# EAGLE schematic switcher (EAGLE 7.4.0)
Line-Tracking Robot Project
DATE: 2015/09/23; DESIGNER: iPAS; PROJECT: Line-Tracking Robot
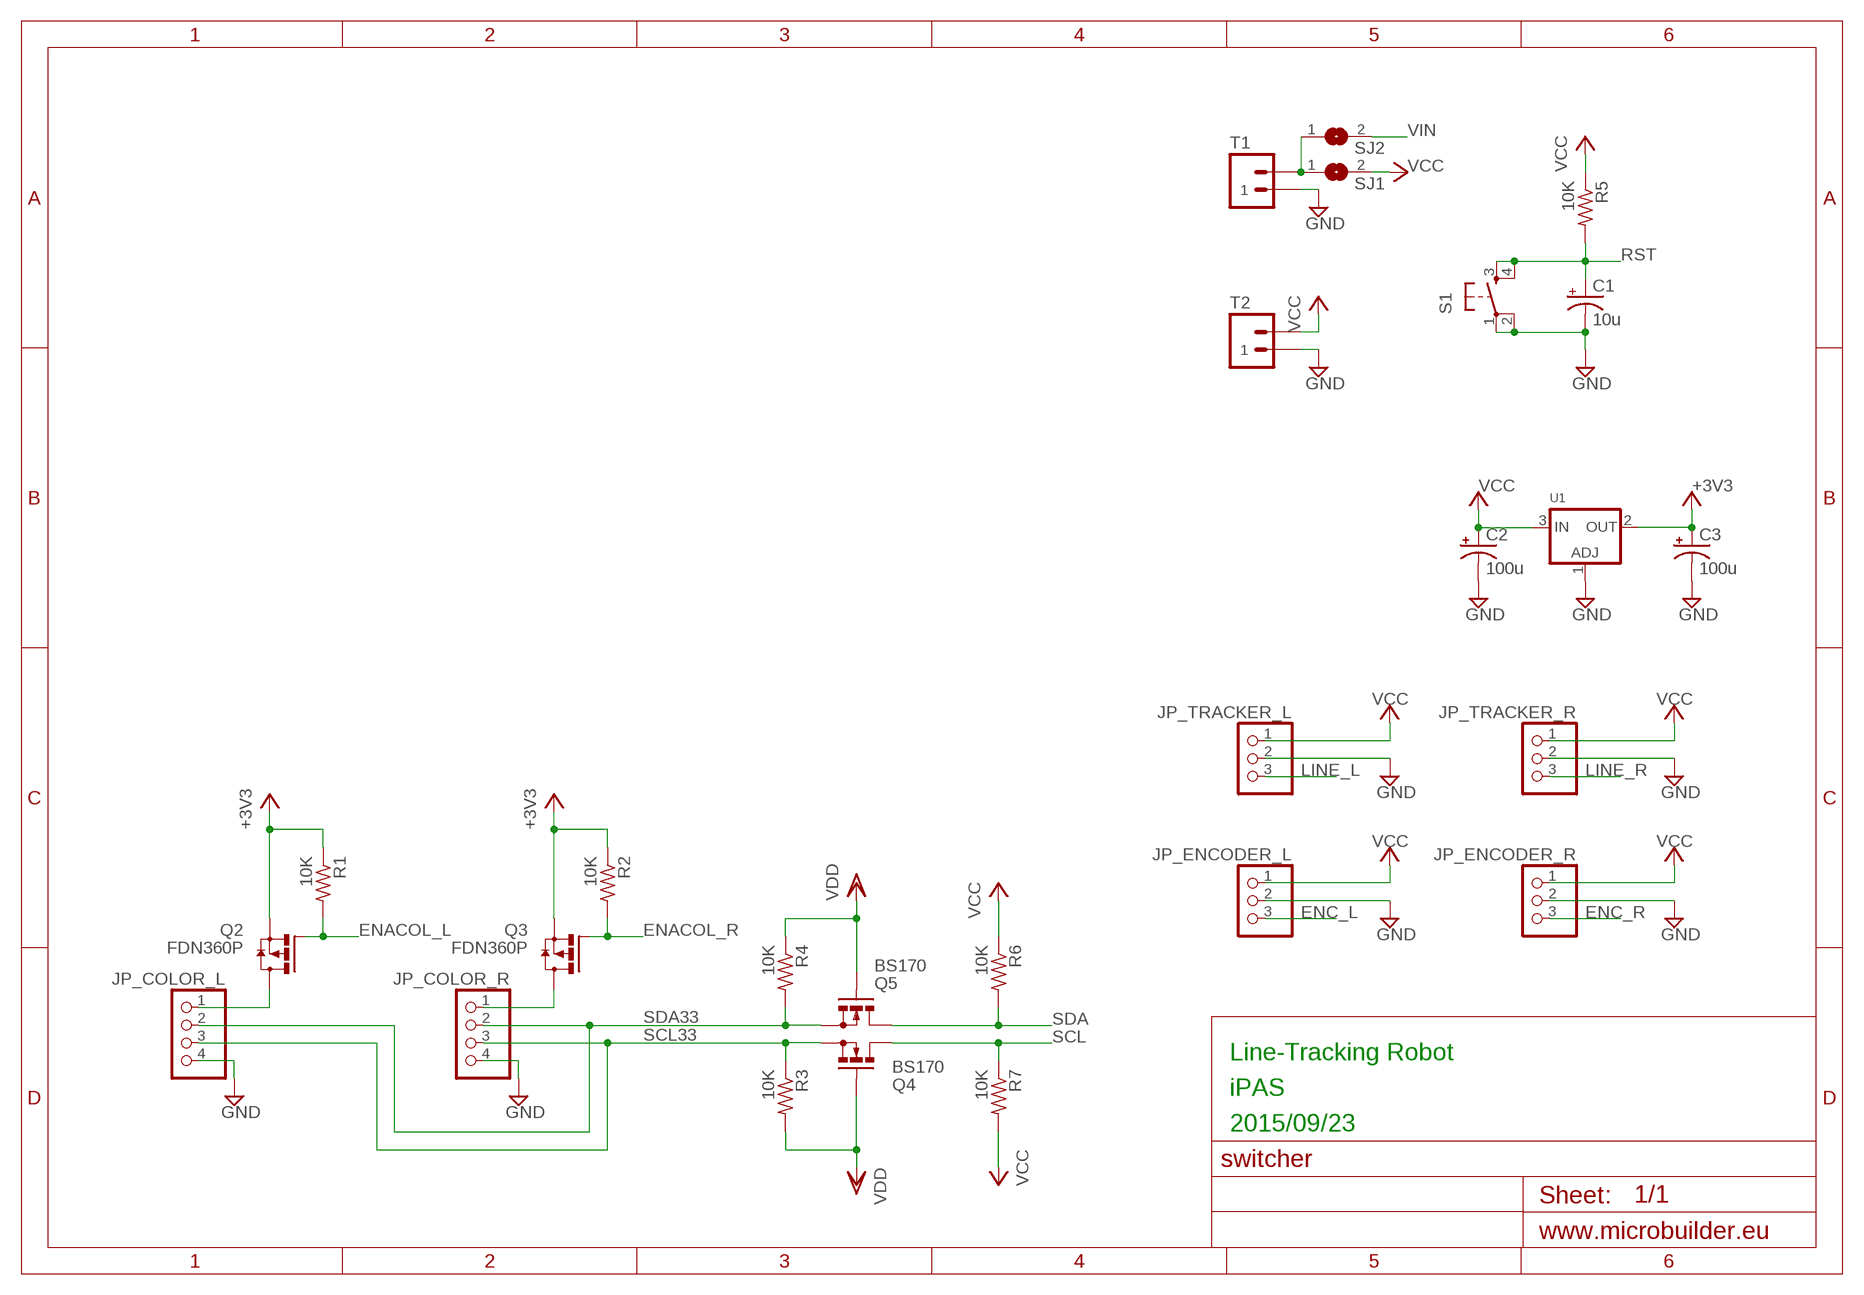
[diagram p0: schematic, sheet 1]

## Parts
C1  10u  RCL_CPOL-USE2.5-6  [RCL_E2,5-6]
C2  100u  RCL_CPOL-USE2.5-6  [RCL_E2,5-6]
C3  100u  RCL_CPOL-USE2.5-6  [RCL_E2,5-6]
JP_COLOR_L  HEADER-1X4ROUND  [1X04_ROUND]
JP_COLOR_R  HEADER-1X4ROUND  [1X04_ROUND]
JP_ENCODER_L  HEADER-1X3ROUND  [1X03_ROUND]
JP_ENCODER_R  HEADER-1X3ROUND  [1X03_ROUND]
JP_TRACKER_L  HEADER-1X3ROUND  [1X03_ROUND]
JP_TRACKER_R  HEADER-1X3ROUND  [1X03_ROUND]
Q2  FDN360P  [SUPER-SOT3]
Q3  FDN360P  [SUPER-SOT3]
Q4  BS170  [TO92-]
Q5  BS170  [TO92-]
R1  10K  RCL_R-US0204/5  [RCL_0204/5]
R2  10K  RCL_R-US0204/5  [RCL_0204/5]
R3  10K  RCL_R-US0204/5  [RCL_0204/5]
R4  10K  RCL_R-US0204/5  [RCL_0204/5]
R5  10K  RCL_R-US0204/5  [RCL_0204/5]
R6  10K  RCL_R-US0204/5  [RCL_0204/5]
R7  10K  RCL_R-US0204/5  [RCL_0204/5]
S1  SWITCH-TACT_DTS-6  [SWITCH-TACT_DTS-6]
SJ1  SOLDERJUMPERREFLOW  [SOLDERJUMPER_REFLOW]
SJ2  SOLDERJUMPERREFLOW  [SOLDERJUMPER_REFLOW]
T1  ST02-3.81MM  [DG381-02P]
T2  ST02-3.81MM  [DG381-02P]
U1  LM1117SOT223-REFLOW  [SOT223-R]

## Nets
+3V3: C3.+ Q2.2(S) Q3.2(S) R1.1 R2.1 U1.2(OUT)
ENACOL_L: Q2.1(G) R1.2
ENACOL_R: Q3.1(G) R2.2
ENC_L: JP_ENCODER_L.3
ENC_R: JP_ENCODER_R.3
GND: C1.- C2.- C3.- JP_COLOR_L.4 JP_COLOR_R.4 JP_ENCODER_L.2 JP_ENCODER_R.2 JP_TRACKER_L.2 JP_TRACKER_R.2 S1.1 S1.2 T1.1 T2.1 U1.1(ADJ)
LINE_L: JP_TRACKER_L.3
LINE_R: JP_TRACKER_R.3
N$1: JP_COLOR_R.1 Q3.3(D)
N$3: JP_COLOR_L.1 Q2.3(D)
N$6: SJ1.1 SJ2.1 T1.2
RST: C1.+ R5.2 S1.3 S1.4
SCL: Q4.1(D) R7.1
SCL33: JP_COLOR_L.3 JP_COLOR_R.3 Q4.3(S) R3.1
SDA: Q5.1(D) R6.2
SDA33: JP_COLOR_L.2 JP_COLOR_R.2 Q5.3(S) R4.2
VCC: C2.+ JP_ENCODER_L.1 JP_ENCODER_R.1 JP_TRACKER_L.1 JP_TRACKER_R.1 R5.1 R6.1 R7.2 SJ1.2 T2.2 U1.3(IN)
VDD: Q4.2(G) Q5.2(G) R3.2 R4.1
VIN: SJ2.2

## Library data of the parts
C1-C3 = ipas:RCL_CPOL-US: POLARIZED CAPACITOR, American symbol
JP_COLOR_L JP_COLOR_R = microbuilder:HEADER-1X4: PIN HEADER
JP_ENCODER_L JP_ENCODER_R JP_TRACKER_L JP_TRACKER_R = microbuilder:HEADER-1X3: PIN HEADER
Q2 Q3 = transistor-power:FDN360P: Single P-Channel, PowerTrench (R) MOSFET Source: http://www.fairchildsemi.com/ds/FD/FDN360P.pdf
Q4 Q5 = ipas:BS170: N-CHANNEL MOS FET Small Signal MOSFET 500 mA, 60 Volts
R1-R7 = ipas:RCL_R-US: RESISTOR, American symbol
S1 = ipas:SWITCH-TACT_DTS-6: DTS-6 Series CONTACT RATING: 12VDC, 50mA (Max) CONTACT RESISTANCE: 100mΩ Max. www.aeontekasia.com/pdf/DTS-6.pdf
SJ1 SJ2 = ipas:SOLDERJUMPER: SMD Solder JUMPER Solder the two pads together to create a connection, or remove the solder to break it. REFLOW - Use this footprint for solder paste and reflow ovens. WAVE - Use this footprint for hand-soldering (larger pads). CLOSED - Has a trace between the two pads to ensure it is closed by default. The trace needs to be cut to disable the jumper, and can be closed again by creating a solder bridge between the two pads.
T1 T2 = ipas:ST02: Screw Terminal Block - 2 Way -5MM: EK500V series. Rated at 20A, 300VAC. Cable size: 2mm² Supplier: Altronics P2034A Source: http://www.dinkle.com/upfiles/proter21253708953.pdf -5.08MM: The back half of a EK500V4R-04P. Rated at 20A, 300VAC. Cable size: 2mm² Supplier: Altronics P2024 (half of) Source: http://www.dinkle.com/upfiles/proter21253708833.pdf -3.5MM: ED350V series. Rated at 10A, 300VAC. Cable size: 1.4mm² Supplier: Altronics P2028 Source: http://www.dinkle.com/upfiles/proter21253714491.pdf -3.81MM: DG381 series. Rated at 20A, 300VAC. Cable size: 1mm² Supplier: DEGSON
U1 = microbuilder:LM1117: LM1117 Voltage Regulator LM1117 Adjustable Voltage regulator [Digikey: LM1117IMP-ADJDKR-ND] LM1117 3.3V Voltage regulator [AP1117E33GDIDKR-ND] LM1117 5.0V Voltage regulator [AP1117E50GDIDKR-ND] SOT223-REFLOW - SOT223 package for solder paste/reflow ovens SOT223-WAVE - SOT223 package for hand-soldering (larger pads) Note: For the fixed-voltage regulators, simply set the ADJ pin to GND.